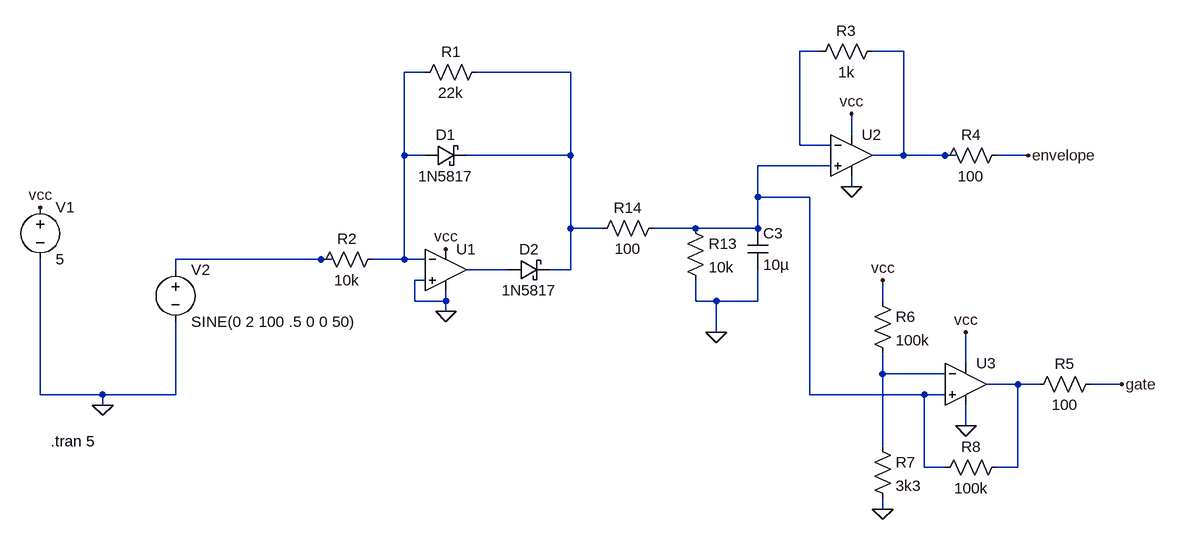
[diagram p0: schematic sound_detector.asc]
sound_detector.asc, the LTspice schematic file:
Version 4
SHEET 1 1720 756
WIRE 1184 -112 1152 -112
WIRE 1312 -112 1264 -112
WIRE 576 -80 544 -80
WIRE 800 -80 656 -80
WIRE 1232 16 1232 -16
WIRE 1152 32 1152 -112
WIRE 1200 32 1152 32
WIRE 544 48 544 -80
WIRE 576 48 544 48
WIRE 800 48 800 -80
WIRE 800 48 640 48
WIRE 1312 48 1312 -112
WIRE 1312 48 1264 48
WIRE 1376 48 1312 48
WIRE 1392 48 1376 48
WIRE 1504 48 1456 48
WIRE 1200 64 1088 64
WIRE 1232 96 1232 80
WIRE 1088 112 1088 64
WIRE 1168 112 1088 112
WIRE 800 160 800 48
WIRE 848 160 800 160
WIRE 992 160 928 160
WIRE 1088 160 1088 112
WIRE 1088 160 992 160
WIRE 416 208 192 208
WIRE 432 208 416 208
WIRE 544 208 544 48
WIRE 544 208 496 208
WIRE 576 208 544 208
WIRE 192 224 192 208
WIRE 704 224 640 224
WIRE 800 224 800 160
WIRE 800 224 768 224
WIRE 576 240 560 240
WIRE 560 272 560 240
WIRE 608 272 608 256
WIRE 608 272 560 272
WIRE 992 272 992 240
WIRE 1024 272 992 272
WIRE 1088 272 1088 224
WIRE 1088 272 1024 272
WIRE 1280 272 1280 240
WIRE 608 288 608 272
WIRE 1024 320 1024 272
WIRE 1408 368 1408 320
WIRE 1280 384 1280 352
WIRE 1376 384 1280 384
WIRE 1488 400 1440 400
WIRE 1520 400 1488 400
WIRE 1648 400 1600 400
WIRE -16 416 -16 208
WIRE 80 416 -16 416
WIRE 192 416 192 304
WIRE 192 416 80 416
WIRE 1168 416 1168 112
WIRE 1344 416 1168 416
WIRE 1376 416 1344 416
WIRE 80 432 80 416
WIRE 1408 464 1408 432
WIRE 1280 496 1280 384
WIRE 1344 528 1344 416
WIRE 1376 528 1344 528
WIRE 1488 528 1488 400
WIRE 1488 528 1456 528
WIRE 1280 592 1280 576
FLAG 80 432 0
FLAG 608 288 0
FLAG -16 128 vcc
FLAG 608 192 vcc
FLAG 1024 320 0
FLAG 1232 96 0
FLAG 1232 -16 vcc
FLAG 1504 48 envelope
FLAG 1280 592 0
FLAG 1408 464 0
FLAG 1280 240 vcc
FLAG 1408 320 vcc
FLAG 1648 400 gate
SYMBOL voltage -16 112 R0
WINDOW 123 0 0 Left 2
WINDOW 39 0 0 Left 2
SYMATTR InstName V1
SYMATTR Value 5
SYMBOL voltage 192 208 R0
WINDOW 123 0 0 Left 2
WINDOW 39 0 0 Left 2
SYMATTR InstName V2
SYMATTR Value SINE(0 2 100 .5 0 0 50)
SYMBOL Opamps\\UniversalOpamp2 608 224 R0
SYMATTR InstName U1
SYMBOL schottky 576 64 R270
WINDOW 0 32 32 VTop 2
WINDOW 3 0 32 VBottom 2
SYMATTR InstName D1
SYMATTR Value 1N5817
SYMATTR Description Diode
SYMATTR Type diode
SYMBOL schottky 704 240 R270
WINDOW 0 32 32 VTop 2
WINDOW 3 0 32 VBottom 2
SYMATTR InstName D2
SYMATTR Value 1N5817
SYMATTR Description Diode
SYMATTR Type diode
SYMBOL res 672 -96 R90
WINDOW 0 0 56 VBottom 2
WINDOW 3 32 56 VTop 2
SYMATTR InstName R1
SYMATTR Value 22k
SYMBOL res 512 192 R90
WINDOW 0 0 56 VBottom 2
WINDOW 3 32 56 VTop 2
SYMATTR InstName R2
SYMATTR Value 10k
SYMBOL res 976 144 R0
SYMATTR InstName R13
SYMATTR Value 10k
SYMBOL res 944 144 R90
WINDOW 0 0 56 VBottom 2
WINDOW 3 32 56 VTop 2
SYMATTR InstName R14
SYMATTR Value 100
SYMBOL cap 1072 160 R0
SYMATTR InstName C3
SYMATTR Value 10µ
SYMBOL Opamps\\UniversalOpamp2 1232 48 R0
SYMATTR InstName U2
SYMBOL res 1280 -128 R90
WINDOW 0 0 56 VBottom 2
WINDOW 3 32 56 VTop 2
SYMATTR InstName R3
SYMATTR Value 1k
SYMBOL res 1472 32 R90
WINDOW 0 0 56 VBottom 2
WINDOW 3 32 56 VTop 2
SYMATTR InstName R4
SYMATTR Value 100
SYMBOL Opamps\\UniversalOpamp2 1408 400 R0
SYMATTR InstName U3
SYMBOL res 1616 384 R90
WINDOW 0 0 56 VBottom 2
WINDOW 3 32 56 VTop 2
SYMATTR InstName R5
SYMATTR Value 100
SYMBOL res 1264 256 R0
SYMATTR InstName R6
SYMATTR Value 100k
SYMBOL res 1264 480 R0
SYMATTR InstName R7
SYMATTR Value 3k3
SYMBOL res 1472 512 R90
WINDOW 0 0 56 VBottom 2
WINDOW 3 32 56 VTop 2
SYMATTR InstName R8
SYMATTR Value 100k
TEXT 0 488 Left 2 !.tran 5

The netlist it stands for:
* sound_detector.asc
V1 vcc 0 5
V2 N006 0 SINE(0 2 100 .5 0 0 50)
XU1 0 N003 vcc 0 N007 level.2 Avol=1Meg GBW=10Meg Slew=10Meg ilimit=25m rail=0 Vos=0 phimargin=45 en=0 enk=0 in=0 ink=0 Rin=500Meg  ; pins IN+ IN- V+ V- OUT
D1 N003 N004 1N5817
D2 N007 N004 1N5817
R1 N004 N003 22k
R2 N003 N006 10k
R13 N005 0 10k
R14 N005 N004 100
C3 N005 0 10µ
XU2 N005 N001 vcc 0 N002 level.2 Avol=1Meg GBW=10Meg Slew=10Meg ilimit=25m rail=0 Vos=0 phimargin=45 en=0 enk=0 in=0 ink=0 Rin=500Meg  ; pins IN+ IN- V+ V- OUT
R3 N002 N001 1k
R4 envelope N002 100
XU3 N005 N008 vcc 0 N009 level.2 Avol=1Meg GBW=10Meg Slew=10Meg ilimit=25m rail=0 Vos=0 phimargin=45 en=0 enk=0 in=0 ink=0 Rin=500Meg  ; pins IN+ IN- V+ V- OUT
R5 gate N009 100
R6 vcc N008 100k
R7 N008 0 3k3
R8 N009 N005 100k
.model D D
.lib standard.dio
.tran 5
.lib UniversalOpamps2.sub
.backanno
.end